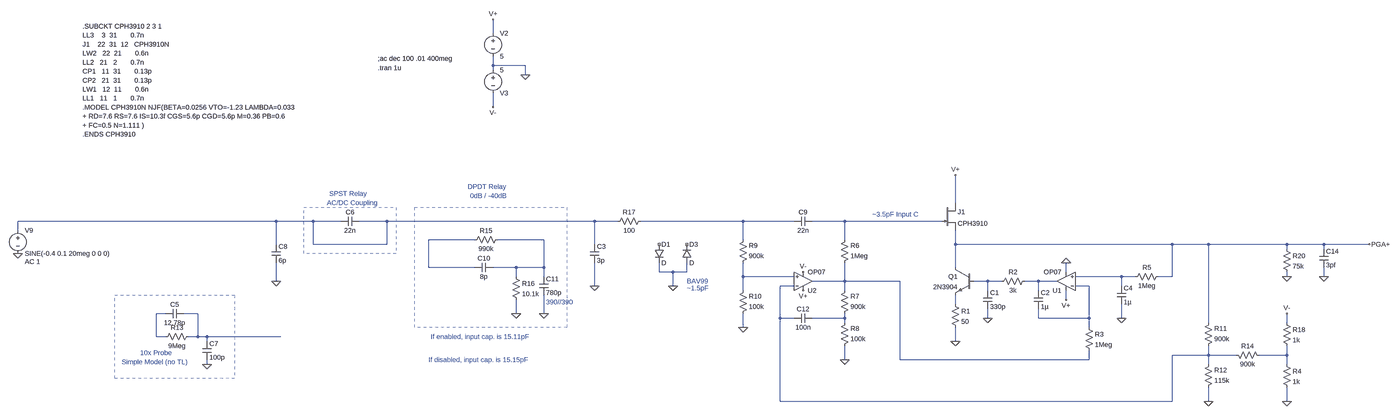
[diagram p0: schematic Rev3_Buffer_Amp.asc, whole sheet]
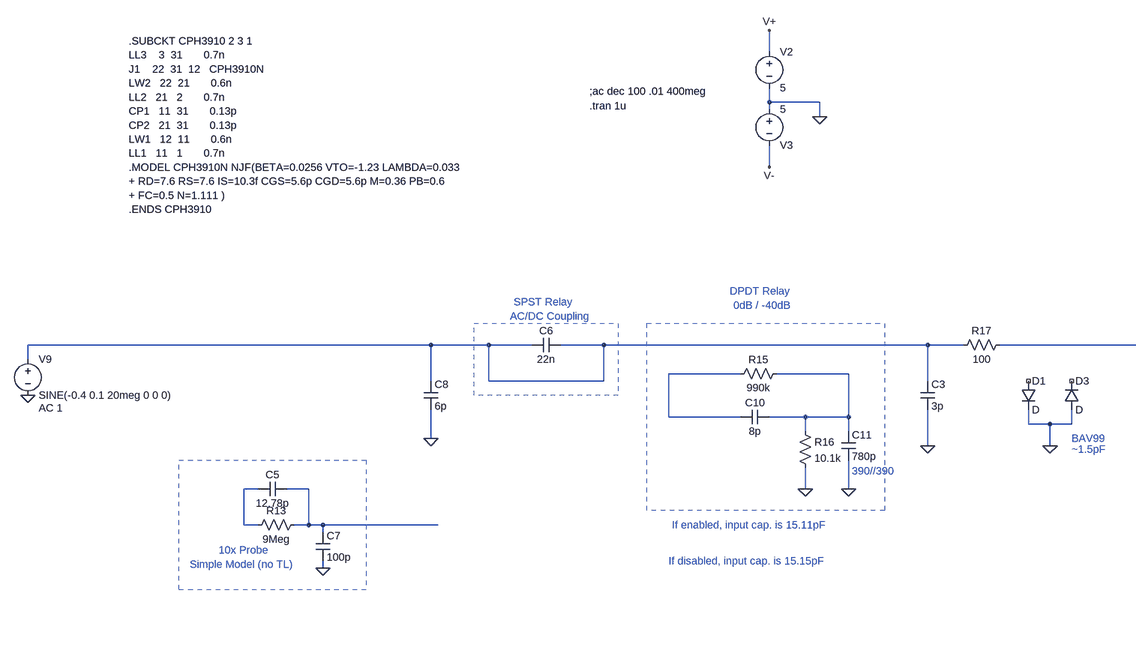
[diagram p1: schematic Rev3_Buffer_Amp.asc, part, row 1 of 1, column 1 of 2]
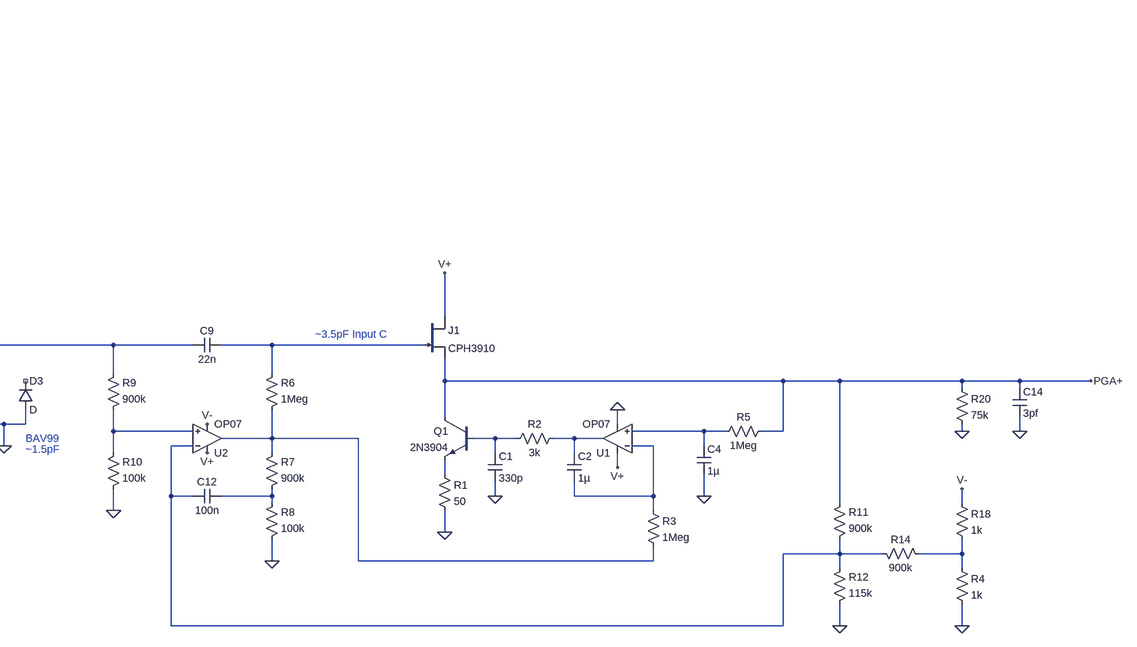
[diagram p2: schematic Rev3_Buffer_Amp.asc, part, row 1 of 1, column 2 of 2]
Rev3_Buffer_Amp.asc, the LTspice schematic file:
Version 4
SHEET 1 3636 912
WIRE 336 -1936 336 -1984
WIRE 336 -1824 336 -1856
WIRE 448 -1824 336 -1824
WIRE 336 -1808 336 -1824
WIRE 448 -1792 448 -1824
WIRE 336 -1680 336 -1728
WIRE 2016 -1040 2016 -1136
WIRE -416 -976 -1312 -976
WIRE -288 -976 -416 -976
WIRE -192 -976 -288 -976
WIRE -32 -976 -128 -976
WIRE 688 -976 -32 -976
WIRE 768 -976 688 -976
WIRE 1280 -976 848 -976
WIRE 1456 -976 1280 -976
WIRE 1632 -976 1520 -976
WIRE 1968 -976 1632 -976
WIRE -1312 -944 -1312 -976
WIRE 272 -912 112 -912
WIRE 512 -912 352 -912
WIRE 1280 -912 1280 -976
WIRE 1632 -912 1632 -976
WIRE -416 -896 -416 -976
WIRE -288 -896 -288 -976
WIRE -32 -896 -32 -976
WIRE -32 -896 -288 -896
WIRE 688 -896 688 -976
WIRE 2016 -896 2016 -944
WIRE 2768 -896 2016 -896
WIRE 2912 -896 2768 -896
WIRE 3184 -896 2912 -896
WIRE 3312 -896 3184 -896
WIRE 3472 -896 3312 -896
WIRE 3184 -880 3184 -896
WIRE 3312 -880 3312 -896
WIRE 112 -816 112 -912
WIRE 272 -816 112 -816
WIRE 416 -816 336 -816
WIRE 512 -816 512 -912
WIRE 512 -816 416 -816
WIRE 2016 -816 2016 -896
WIRE 912 -800 912 -832
WIRE 960 -800 912 -800
WIRE 1008 -800 1008 -832
WIRE 1008 -800 960 -800
WIRE 2400 -800 2400 -832
WIRE 416 -784 416 -816
WIRE 512 -784 512 -816
WIRE 1280 -784 1280 -832
WIRE 1456 -784 1280 -784
WIRE 2592 -784 2432 -784
WIRE 2640 -784 2592 -784
WIRE 2768 -784 2768 -896
WIRE 2768 -784 2720 -784
WIRE 3184 -784 3184 -800
WIRE 3312 -784 3312 -816
WIRE -416 -768 -416 -832
WIRE 1632 -768 1632 -832
WIRE 1632 -768 1520 -768
WIRE 1824 -768 1632 -768
WIRE 2128 -768 2080 -768
WIRE 2176 -768 2128 -768
WIRE 2304 -768 2256 -768
WIRE 2368 -768 2304 -768
WIRE 688 -752 688 -832
WIRE 960 -752 960 -800
WIRE 1456 -752 1408 -752
WIRE 2480 -752 2432 -752
WIRE 2592 -752 2592 -784
WIRE 1280 -736 1280 -784
WIRE 1632 -736 1632 -768
WIRE 2128 -736 2128 -768
WIRE 2304 -736 2304 -768
WIRE 2400 -704 2400 -736
WIRE 2016 -688 2016 -720
WIRE -800 -656 -832 -656
WIRE -688 -656 -736 -656
WIRE 416 -656 416 -704
WIRE 512 -656 512 -720
WIRE 1408 -640 1408 -752
WIRE 1456 -640 1408 -640
WIRE 1632 -640 1632 -656
WIRE 1632 -640 1520 -640
WIRE 2128 -640 2128 -672
WIRE 2304 -640 2304 -672
WIRE 2480 -640 2480 -752
WIRE 2480 -640 2304 -640
WIRE 2592 -640 2592 -688
WIRE 1632 -624 1632 -640
WIRE 2912 -624 2912 -896
WIRE 3184 -624 3184 -656
WIRE 1280 -608 1280 -656
WIRE 2480 -608 2480 -640
WIRE -832 -576 -832 -656
WIRE -800 -576 -832 -576
WIRE -688 -576 -688 -656
WIRE -688 -576 -720 -576
WIRE -656 -576 -688 -576
WIRE -400 -576 -656 -576
WIRE -656 -560 -656 -576
WIRE 2016 -560 2016 -608
WIRE 2912 -512 2912 -544
WIRE 2912 -512 2768 -512
WIRE 3008 -512 2912 -512
WIRE 3184 -512 3184 -544
WIRE 3184 -512 3088 -512
WIRE 1632 -496 1632 -544
WIRE 1824 -496 1824 -768
WIRE 2480 -496 2480 -528
WIRE 2480 -496 1824 -496
WIRE -656 -480 -656 -496
WIRE 2912 -480 2912 -512
WIRE 3184 -480 3184 -512
WIRE 1408 -352 1408 -640
WIRE 2768 -352 2768 -512
WIRE 2768 -352 1408 -352
WIRE 2912 -352 2912 -400
WIRE 3184 -352 3184 -400
FLAG 2016 -1136 V+
FLAG 2400 -704 V+
FLAG 2128 -640 0
FLAG 2592 -640 0
FLAG 448 -1792 0
FLAG 336 -1984 V+
FLAG 336 -1680 V-
FLAG -1312 -864 0
FLAG 3184 -784 0
FLAG 3312 -784 0
FLAG 3472 -896 PGA+
FLAG 1488 -736 V+
FLAG 1488 -800 V-
FLAG 1280 -608 0
FLAG 1632 -496 0
FLAG 2912 -352 0
FLAG 3184 -352 0
FLAG 688 -752 0
FLAG -416 -768 0
FLAG 416 -656 0
FLAG 512 -656 0
FLAG -656 -480 0
FLAG 960 -752 0
FLAG 2016 -560 0
FLAG 3184 -656 V-
FLAG 2400 -832 0
SYMBOL npn 2080 -816 M0
SYMATTR InstName Q1
SYMATTR Value 2N3904
SYMBOL res 2000 -704 R0
SYMATTR InstName R1
SYMATTR Value 50
SYMBOL Opamps\\OP07 2400 -704 R180
SYMATTR InstName U1
SYMBOL res 2272 -784 R90
WINDOW 0 0 56 VBottom 2
WINDOW 3 32 56 VTop 2
SYMATTR InstName R2
SYMATTR Value 3k
SYMBOL cap 2112 -736 R0
SYMATTR InstName C1
SYMATTR Value 330p
SYMBOL cap 2288 -736 R0
SYMATTR InstName C2
SYMATTR Value 1µ
SYMBOL res 2736 -800 R90
WINDOW 0 0 56 VBottom 2
WINDOW 3 32 56 VTop 2
SYMATTR InstName R5
SYMATTR Value 1Meg
SYMBOL cap 2576 -752 R0
SYMATTR InstName C4
SYMATTR Value 1µ
SYMBOL voltage 336 -1952 R0
WINDOW 123 0 0 Left 0
WINDOW 39 0 0 Left 0
SYMATTR InstName V2
SYMATTR Value 5
SYMBOL voltage 336 -1824 R0
WINDOW 0 24 96 Left 2
WINDOW 3 24 16 Left 2
WINDOW 123 0 0 Left 0
WINDOW 39 0 0 Left 0
SYMATTR InstName V3
SYMATTR Value 5
SYMBOL cap 1520 -992 R90
WINDOW 0 0 32 VBottom 2
WINDOW 3 32 32 VTop 2
SYMATTR InstName C9
SYMATTR Value 22n
SYMBOL voltage -1312 -960 R0
WINDOW 123 24 124 Left 2
WINDOW 39 24 152 Left 2
SYMATTR Value2 AC 1
SYMATTR InstName V9
SYMATTR Value SINE(-0.4 0.1 20meg 0 0 0)
SYMBOL res 3168 -896 R0
SYMATTR InstName R20
SYMATTR Value 75k
SYMBOL cap 3296 -880 R0
SYMATTR InstName C14
SYMATTR Value 3pf
SYMBOL Opamps\\OP07 1488 -704 M180
SYMATTR InstName U2
SYMBOL res 1616 -816 M180
WINDOW 0 36 76 Left 2
WINDOW 3 36 40 Left 2
SYMATTR InstName R6
SYMATTR Value 1Meg
SYMBOL res 1616 -640 M180
WINDOW 0 36 76 Left 2
WINDOW 3 36 40 Left 2
SYMATTR InstName R7
SYMATTR Value 900k
SYMBOL res 1616 -528 M180
WINDOW 0 36 76 Left 2
WINDOW 3 36 40 Left 2
SYMATTR InstName R8
SYMATTR Value 100k
SYMBOL res 1264 -816 M180
WINDOW 0 36 76 Left 2
WINDOW 3 36 40 Left 2
SYMATTR InstName R9
SYMATTR Value 900k
SYMBOL res 1264 -640 M180
WINDOW 0 36 76 Left 2
WINDOW 3 36 40 Left 2
SYMATTR InstName R10
SYMATTR Value 100k
SYMBOL res 2896 -528 M180
WINDOW 0 36 76 Left 2
WINDOW 3 36 40 Left 2
SYMATTR InstName R11
SYMATTR Value 900k
SYMBOL res 2896 -384 M180
WINDOW 0 36 76 Left 2
WINDOW 3 36 40 Left 2
SYMATTR InstName R12
SYMATTR Value 115k
SYMBOL res 3104 -496 M270
WINDOW 0 32 56 VTop 2
WINDOW 3 0 56 VBottom 2
SYMATTR InstName R14
SYMATTR Value 900k
SYMBOL cap 672 -896 R0
SYMATTR InstName C3
SYMATTR Value 3p
SYMBOL cap -128 -992 R90
WINDOW 0 0 32 VBottom 2
WINDOW 3 32 32 VTop 2
SYMATTR InstName C6
SYMATTR Value 22n
SYMBOL cap -432 -896 R0
SYMATTR InstName C8
SYMATTR Value 6p
SYMBOL res 368 -928 R90
WINDOW 0 0 56 VBottom 2
WINDOW 3 32 56 VTop 2
SYMATTR InstName R15
SYMATTR Value 990k
SYMBOL cap 336 -832 R90
WINDOW 0 0 32 VBottom 2
WINDOW 3 32 32 VTop 2
SYMATTR InstName C10
SYMATTR Value 8p
SYMBOL res 400 -800 R0
SYMATTR InstName R16
SYMATTR Value 10.1k
SYMBOL cap 496 -784 R0
SYMATTR InstName C11
SYMATTR Value 780p
SYMBOL res -704 -592 R90
WINDOW 0 0 56 VBottom 2
WINDOW 3 32 56 VTop 2
SYMATTR InstName R13
SYMATTR Value 9Meg
SYMBOL cap -736 -672 R90
WINDOW 0 0 32 VBottom 2
WINDOW 3 32 32 VTop 2
SYMATTR InstName C5
SYMATTR Value 12.78p
SYMBOL cap -672 -560 R0
SYMATTR InstName C7
SYMATTR Value 100p
SYMBOL cap 1520 -624 M270
WINDOW 0 32 32 VTop 2
WINDOW 3 0 32 VBottom 2
SYMATTR InstName C12
SYMATTR Value 100n
SYMBOL njf 1968 -1040 R0
SYMATTR InstName J1
SYMATTR Value CPH3910
SYMATTR Prefix X
SYMBOL res 864 -992 R90
WINDOW 0 0 56 VBottom 2
WINDOW 3 32 56 VTop 2
SYMATTR InstName R17
SYMATTR Value 100
SYMBOL diode 896 -896 R0
SYMATTR InstName D1
SYMBOL diode 992 -832 M180
WINDOW 0 24 64 Left 2
WINDOW 3 24 0 Left 2
SYMATTR InstName D3
SYMBOL res 2464 -624 R0
SYMATTR InstName R3
SYMATTR Value 1Meg
SYMBOL res 3168 -496 R0
SYMATTR InstName R4
SYMATTR Value 1k
SYMBOL res 3168 -640 R0
SYMATTR InstName R18
SYMATTR Value 1k
TEXT -64 -1848 Left 2 !;ac dec 100 .01 400meg
TEXT -64 -1816 Left 2 !.tran 1u
TEXT 248 -1096 Left 2 ;DPDT Relay
TEXT 256 -1064 Left 2 ;0dB / -40dB
TEXT -232 -1072 Left 2 ;SPST Relay
TEXT -240 -1040 Left 2 ;AC/DC Coupling
TEXT 120 -576 Left 2 ;If enabled, input cap. is 15.11pF
TEXT 112 -496 Left 2 ;If disabled, input cap. is 15.15pF
TEXT 520 -696 Left 2 ;390//390
TEXT -888 -520 Left 2 ;10x Probe
TEXT -952 -488 Left 2 ;Simple Model (no TL)
TEXT -1088 -1960 Left 2 !.SUBCKT CPH3910 2 3 1\nLL3    3  31       0.7n\nJ1    22  31  12   CPH3910N\nLW2   22  21       0.6n \nLL2   21   2       0.7n  \nCP1   11  31       0.13p\nCP2   21  31       0.13p\nLW1   12  11       0.6n\nLL1   11   1       0.7n\n.MODEL CPH3910N NJF(BETA=0.0256 VTO=-1.23 LAMBDA=0.033\n+ RD=7.6 RS=7.6 IS=10.3f CGS=5.6p CGD=5.6p M=0.36 PB=0.6\n+ FC=0.5 N=1.111 )\n.ENDS CPH3910
TEXT 1728 -1000 Left 2 ;~3.5pF Input C
TEXT 1008 -768 Left 2 ;BAV99
TEXT 1008 -744 Left 2 ;~1.5pF
RECTANGLE Normal 592 -608 64 -1024 2
RECTANGLE Normal 0 -864 -320 -1024 2
RECTANGLE Normal -560 -432 -976 -720 2

The netlist it stands for:
* Rev3_Buffer_Amp.asc
Q1 PGA+ N009 N013 0 2N3904
R1 N013 0 50
XU1 N007 N012 V+ 0 N010 LT1001  ; OP07, pins In+ In- V+ V- OUT
R2 N010 N009 3k
C1 N009 0 330p
C2 N010 N012 1µ
R5 PGA+ N007 1Meg
C4 N007 0 1µ
V2 V+ 0 5
V3 0 V- 5
C9 N003 N002 22n
V9 N001 0 SINE(-0.4 0.1 20meg 0 0 0) AC 1
R20 PGA+ 0 75k
C14 PGA+ 0 3pf
XU2 N006 N011 V+ V- N008 LT1001  ; OP07, pins In+ In- V+ V- OUT
R6 N008 N003 1Meg
R7 N016 N008 900k
R8 0 N016 100k
R9 N006 N002 900k
R10 0 N006 100k
R11 N011 PGA+ 900k
R12 0 N011 115k
R14 N017 N011 900k
C3 N001 0 3p
C6 N001 N001 22n
C8 N001 0 6p
R15 N005 N004 990k
C10 N005 N004 8p
R16 N005 0 10.1k
C11 N005 0 780p
R13 N015 N014 9Meg
C5 N015 N014 12.78p
C7 N015 0 100p
C12 N016 N011 100n
XJ1 V+ N003 PGA+ CPH3910  ; pins D G S
R17 N002 N001 100
D1 NC_01 0 D
D3 0 NC_02 D
R3 N012 N008 1Meg
R4 N017 0 1k
R18 V- N017 1k
.model D D
.lib standard.dio
.model NPN NPN
.model PNP PNP
.lib standard.bjt
;ac dec 100 .01 400meg
.tran 1u
* DPDT Relay
* 0dB / -40dB
* SPST Relay
* AC/DC Coupling
* If enabled, input cap. is 15.11pF
* If disabled, input cap. is 15.15pF
* 390//390
* 10x Probe
* Simple Model (no TL)
.SUBCKT CPH3910 2 3 1
LL3    3  31       0.7n
J1    22  31  12   CPH3910N
LW2   22  21       0.6n
LL2   21   2       0.7n
CP1   11  31       0.13p
CP2   21  31       0.13p
LW1   12  11       0.6n
LL1   11   1       0.7n
.MODEL CPH3910N NJF(BETA=0.0256 VTO=-1.23 LAMBDA=0.033
+ RD=7.6 RS=7.6 IS=10.3f CGS=5.6p CGD=5.6p M=0.36 PB=0.6
+ FC=0.5 N=1.111 )
.ENDS CPH3910
* ~3.5pF Input C
* BAV99
* ~1.5pF
.lib LTC.lib
.backanno
.end